# EAGLE design half-pint-turbidimeter_2.0.2 (EAGLE 7.3.0)
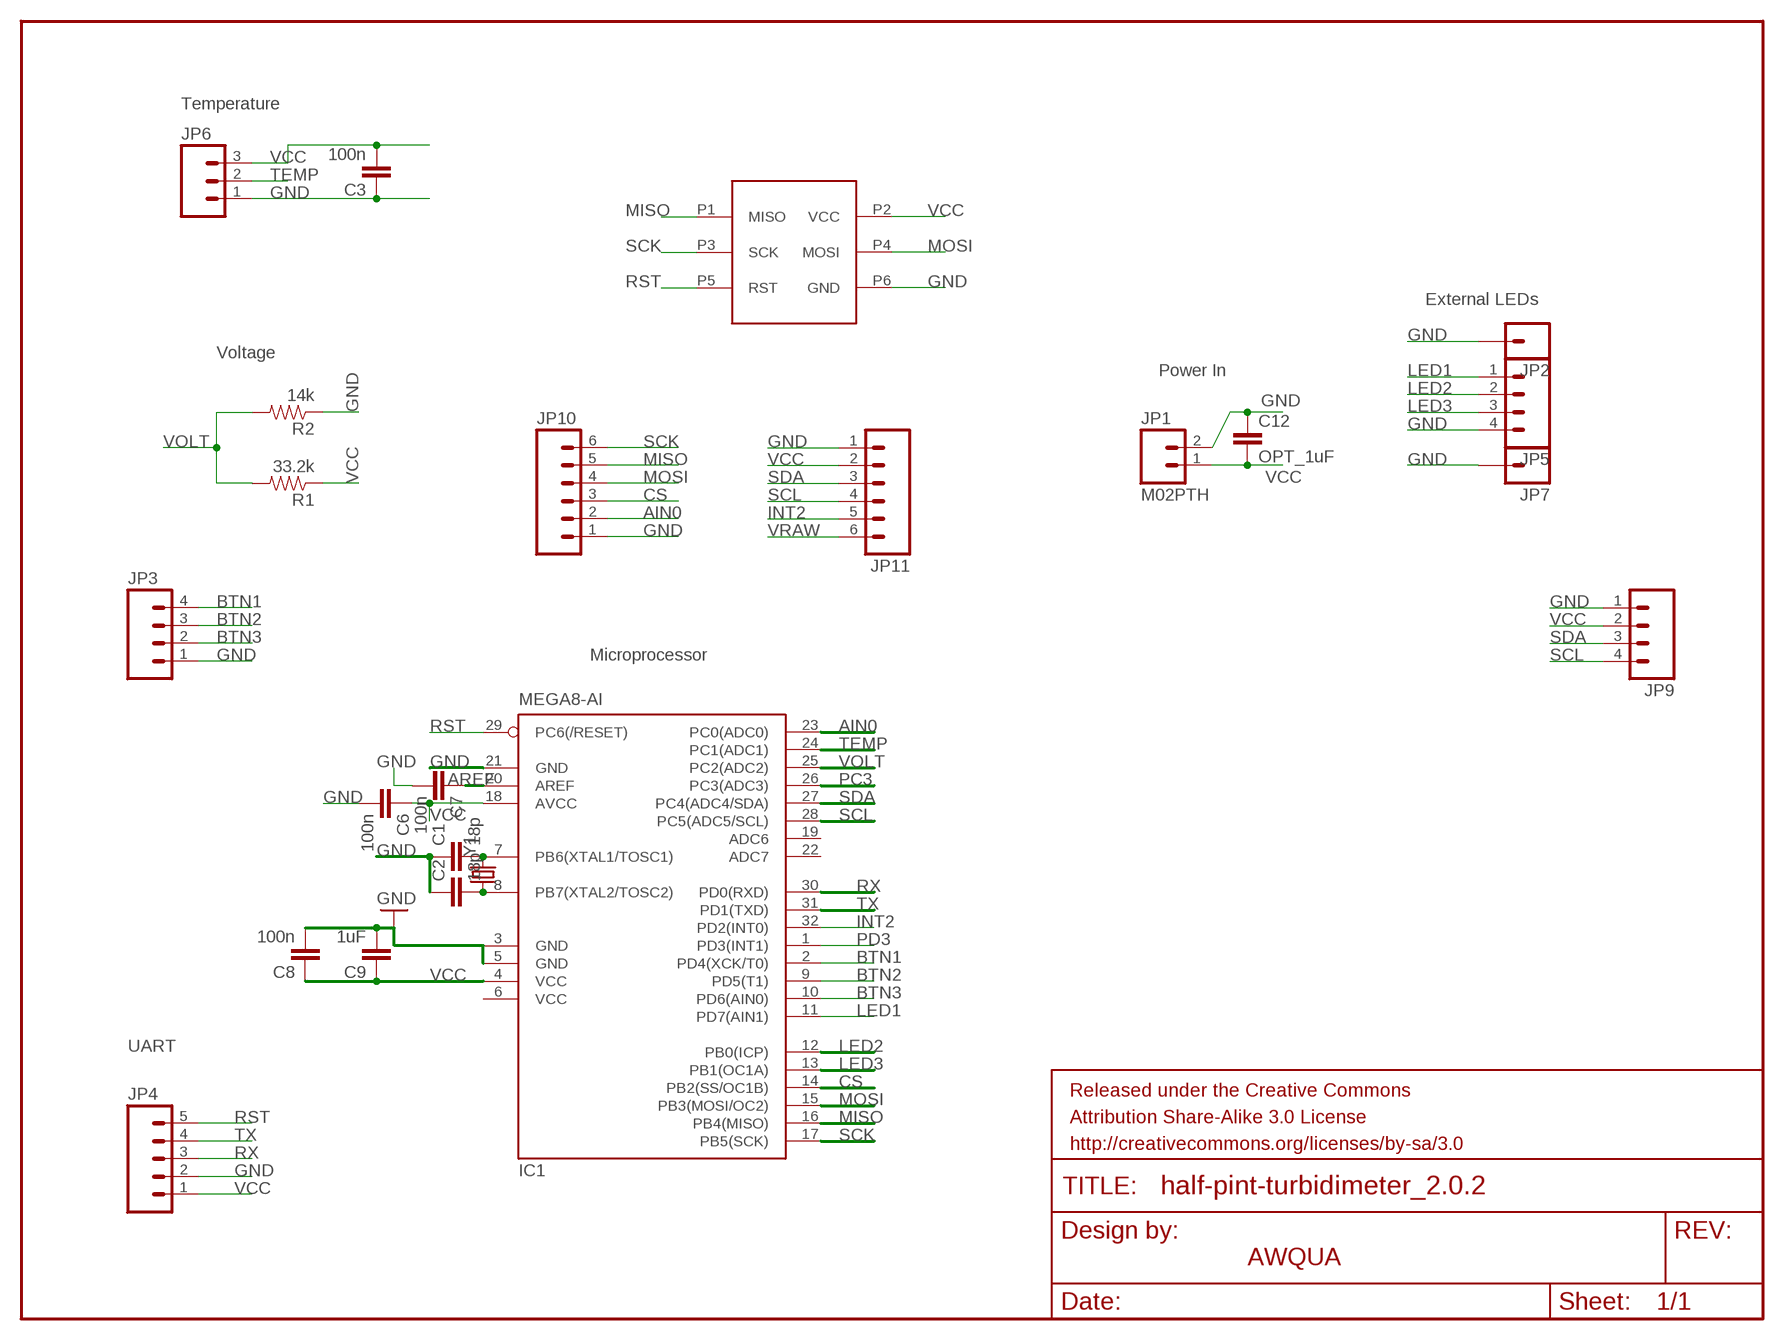
[diagram p0: schematic, sheet 1]

## Parts
C1  18p  CAP0603-CAP  [0603-CAP]
C2  18p  CAP0603-CAP  [0603-CAP]
C3  100n  CAP0603-CAP  [0603-CAP]
C6  100n  CAP0603-CAP  [0603-CAP]
C7  100n  CAP0603-CAP  [0603-CAP]
C8  100n  CAP0603-CAP  [0603-CAP]
C9  1uF  CAP0603-CAP  [0603-CAP]
C12  OPT_1uF  CAP0603-CAP  [0603-CAP]
FRAME1  FRAME-LETTER  [CREATIVE_COMMONS]
IC1  MEGA8-AI  [TQFP32-08]
JP1  M02PTH  [1X02]
JP2  M01PTH  [1X01]
JP3  M04PTH  [1X04]
JP4  M05PTH  [1X05]
JP5  M04PTH  [1X04]
JP6  M03PTH  [1X03]
JP7  M01PTH  [1X01]
JP9  M04PTH  [1X04]
JP10  M06SMD_MALE  [1X06_SMD_MALE]
JP11  M06SMD_MALE  [1X06_SMD_MALE]
R1  33.2k  RESISTOR0603  [0603-RES]
R2  14k  RESISTOR0603  [0603-RES]
U$1  ISP-SMD-6PIN  [ISP-SMD-6PIN]
Y1  CRYSTAL5X3  [CRYSTAL-SMD-5X3]

## Nets
AIN0: IC1.23(PC0(ADC0)) JP10.2
AREF: C7.1 IC1.20(AREF)
BTN1: IC1.2(PD4(XCK/T0)) JP3.4
BTN2: IC1.9(PD5(T1)) JP3.3
BTN3: IC1.10(PD6(AIN0)) JP3.2
CS: IC1.14(PB2(SS/OC1B)) JP10.3
GND: C1.1 C2.1 C3.1 C6.2 C7.2 C8.2 C9.2 C12.1 IC1.3(GND) IC1.5(GND) IC1.21(GND) JP1.2 JP2.1 JP3.1 JP4.2 JP5.4 JP6.1 JP7.1 JP9.1 JP10.1 JP11.1 R2.1 U$1.P6(GND)
INT2: IC1.32(PD2(INT0)) JP11.5
LED1: IC1.11(PD7(AIN1)) JP5.1
LED2: IC1.12(PB0(ICP)) JP5.2
LED3: IC1.13(PB1(OC1A)) JP5.3
MISO: IC1.16(PB4(MISO)) JP10.5 U$1.P1(MISO)
MOSI: IC1.15(PB3(MOSI/OC2)) JP10.4 U$1.P4(MOSI)
PC3: IC1.26(PC3(ADC3))
PD3: IC1.1(PD3(INT1))
Q1: C2.2 IC1.8(PB7(XTAL2/TOSC2)) Y1.1
Q2: C1.2 IC1.7(PB6(XTAL1/TOSC1)) Y1.3
RST: IC1.29(PC6(/RESET)) JP4.5 U$1.P5(RST)
RX: IC1.30(PD0(RXD)) JP4.3
SCK: IC1.17(PB5(SCK)) JP10.6 U$1.P3(SCK)
SCL: IC1.28(PC5(ADC5/SCL)) JP9.4 JP11.4
SDA: IC1.27(PC4(ADC4/SDA)) JP9.3 JP11.3
TEMP: IC1.24(PC1(ADC1)) JP6.2
TX: IC1.31(PD1(TXD)) JP4.4
VCC: C3.2 C6.1 C8.1 C9.1 C12.2 IC1.4(VCC) IC1.18(AVCC) JP1.1 JP4.1 JP6.3 JP9.2 JP11.2 R1.1 U$1.P2(VCC)
VOLT: IC1.25(PC2(ADC2)) R1.2 R2.2
VRAW: JP11.6
Unconnected: IC1.19(ADC6) IC1.22(ADC7)

## Notes on the sheet
- Temperature
- External LEDs
- Voltage
- Power In
- Microprocessor
- UART
- AWQUA

## Power pins joined to a net without a drawn wire
VCC: IC1.6(VCC)

## Library data of the parts
C1-C3 C6-C9 C12 = SparkFun:CAP: Capacitor Standard 0603 ceramic capacitor, and 0.1" leaded capacitor.
FRAME1 = SparkFun-Aesthetics:FRAME-LETTER: Schematic Frame Standard 8.5x11 US Letter frame
IC1 = atmel:MEGA8: MICROCONTROLLER 8 Kbytes FLASH, 1 kbytes SRAM, 512 bytes EEPROM, USART, 6-channel 10 bit ADC, 2-channel 8 bit ADC Pin compatible with Atmega48, ATMega88, ATMega168 Source: avr.lbr; MPN: ATMEGA8-16AU; OC_FARNELL: 9171371; OC_NEWARK: 73M8863
JP1 = SparkFun-Connectors:M02: Standard 2-pin 0.1" header. Use with - straight break away headers ( PRT-00116) - right angle break away headers (PRT-00553) - swiss pins (PRT-00743) - machine pins (PRT-00117) - female headers (PRT-00115) Molex polarized connector foot print use with: PRT-08233 with associated crimp pins and housings. 2.54_SCREWTERM for use with PRT-10571. 3.5mm Screw Terminal footprints for PRT-08084 5mm Screw Terminal footprints for use with PRT-08433
JP2 JP7 = SparkFun-Connectors:M01: Header 1 Standard 1-pin 0.1" header. Use with straight break away headers (SKU : PRT-00116), right angle break away headers (PRT-00553), swiss pins (PRT-00743), machine pins (PRT-00117), and female headers (PRT-00115).
JP3 JP5 JP9 = SparkFun-Connectors:M04: Header 4 Standard 4-pin 0.1" header. Use with straight break away headers (SKU : PRT-00116), right angle break away headers (PRT-00553), swiss pins (PRT-00743), machine pins (PRT-00117), and female headers (PRT-00115). Molex polarized connector foot print use with SKU : PRT-08231 with associated crimp pins and housings. 1MM SMD Version SKU: PRT-10208
JP4 = SparkFun-Connectors:M05: Header 5 Standard 5-pin 0.1" header. Use with straight break away headers (SKU : PRT-00116), right angle break away headers (PRT-00553), swiss pins (PRT-00743), machine pins (PRT-00117), and female headers (PRT-00115). Molex polarized connector foot print use with SKU : PRT-08230 with associated crimp pins and housings.
JP6 = SparkFun-Connectors:M03: Header 3 Standard 3-pin 0.1" header. Use with straight break away headers (SKU : PRT-00116), right angle break away headers (PRT-00553), swiss pins (PRT-00743), machine pins (PRT-00117), and female headers (PRT-00115). Molex polarized connector foot print use with SKU : PRT-08232 with associated crimp pins and housings.
JP10 JP11 = SparkFun-Connectors:M06: Header 6 Standard 6-pin 0.1" header. Use with straight break away headers (SKU : PRT-00116), right angle break away headers (PRT-00553), swiss pins (PRT-00743), machine pins (PRT-00117), and female headers (PRT-00115). Molex polarized connector foot print use with SKU : PRT-08094 with associated crimp pins and housings. NOTES ON THE VARIANTS LOCK and LOCK_LONGPADS... This footprint was designed to help hold the alignment of a through-hole component (i.e. 6-pin header) while soldering it into place. You may notice that each hole has been shifted either up or down by 0.005 of an inch from it's more standard position (which is a perfectly straight line). This slight alteration caused the pins (the squares in the middle) to touch the edges of the holes. Because they are alternating, it causes a "brace" to hold the component in place. 0.005 has proven to be the perfect amount of "off-center" position when using our standard breakaway headers. Although looks a little odd when you look at the bare footprint, once you have a header in there, the alteration is very hard to notice. Also,if you push a header all the way into place, it is covered up entirely on the bottom side. This idea of altering the position of holes to aid alignment will be further integrated into the Sparkfun Library for other footprints. It can help hold any component with 3 or more connection pins.; PROD_ID: CONN-11293
R1 R2 = SparkFun-Resistors:RESISTOR: Resistor Basic schematic elements and footprints for 0603, 1206, and PTH resistors.
U$1 = awqua_eagle_library:ISP-SMD-6PIN
Y1 = SparkFun:CRYSTAL: Crystals Various standard crystals. Proven footprints. Spark Fun Electronics SKU : COM-00534

## Board
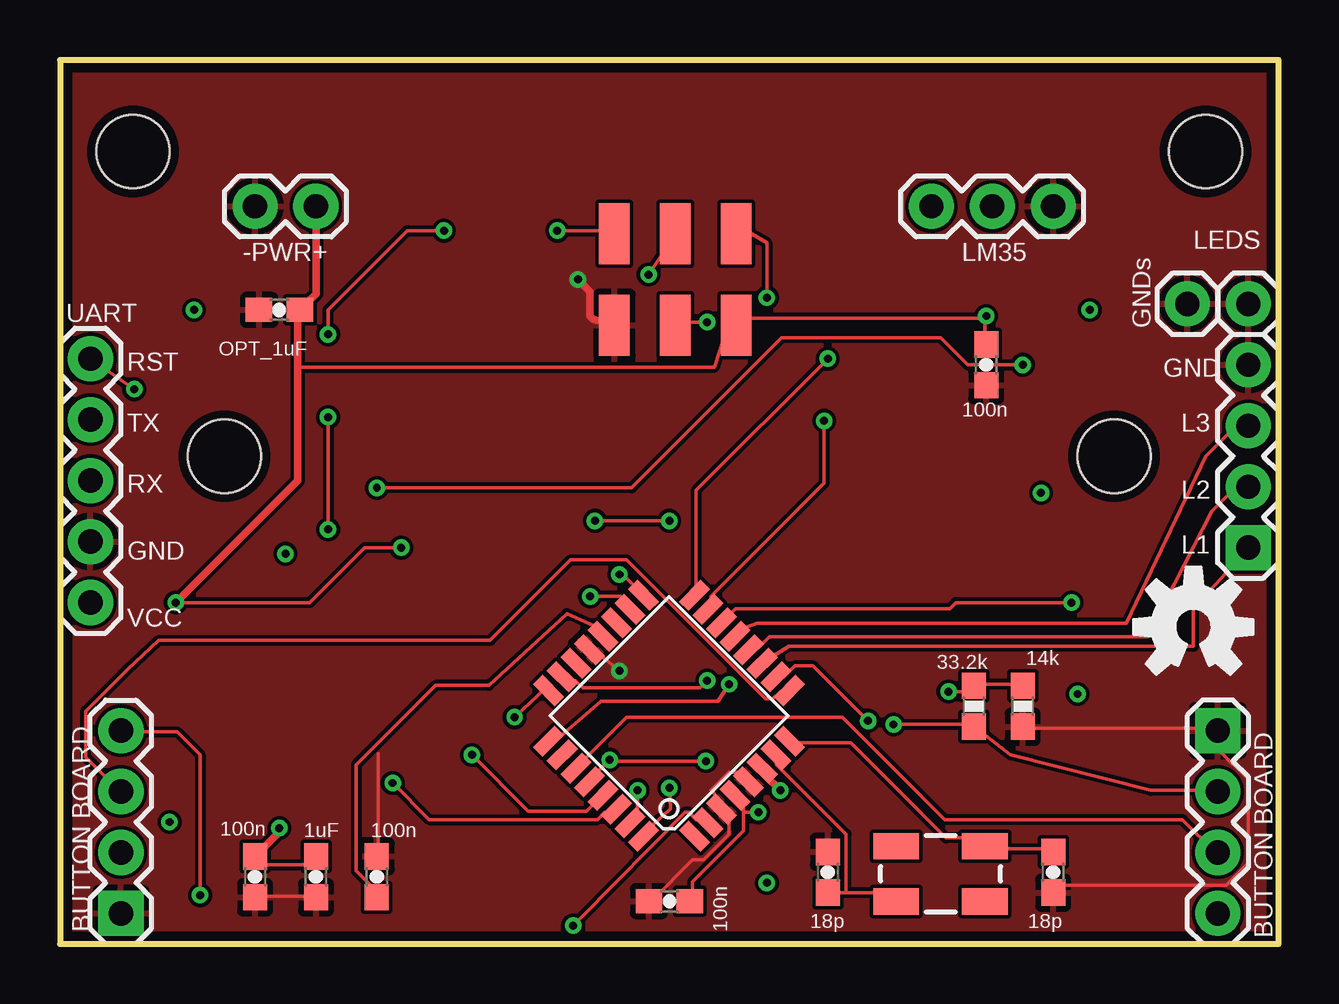
[diagram p1: board, top side]
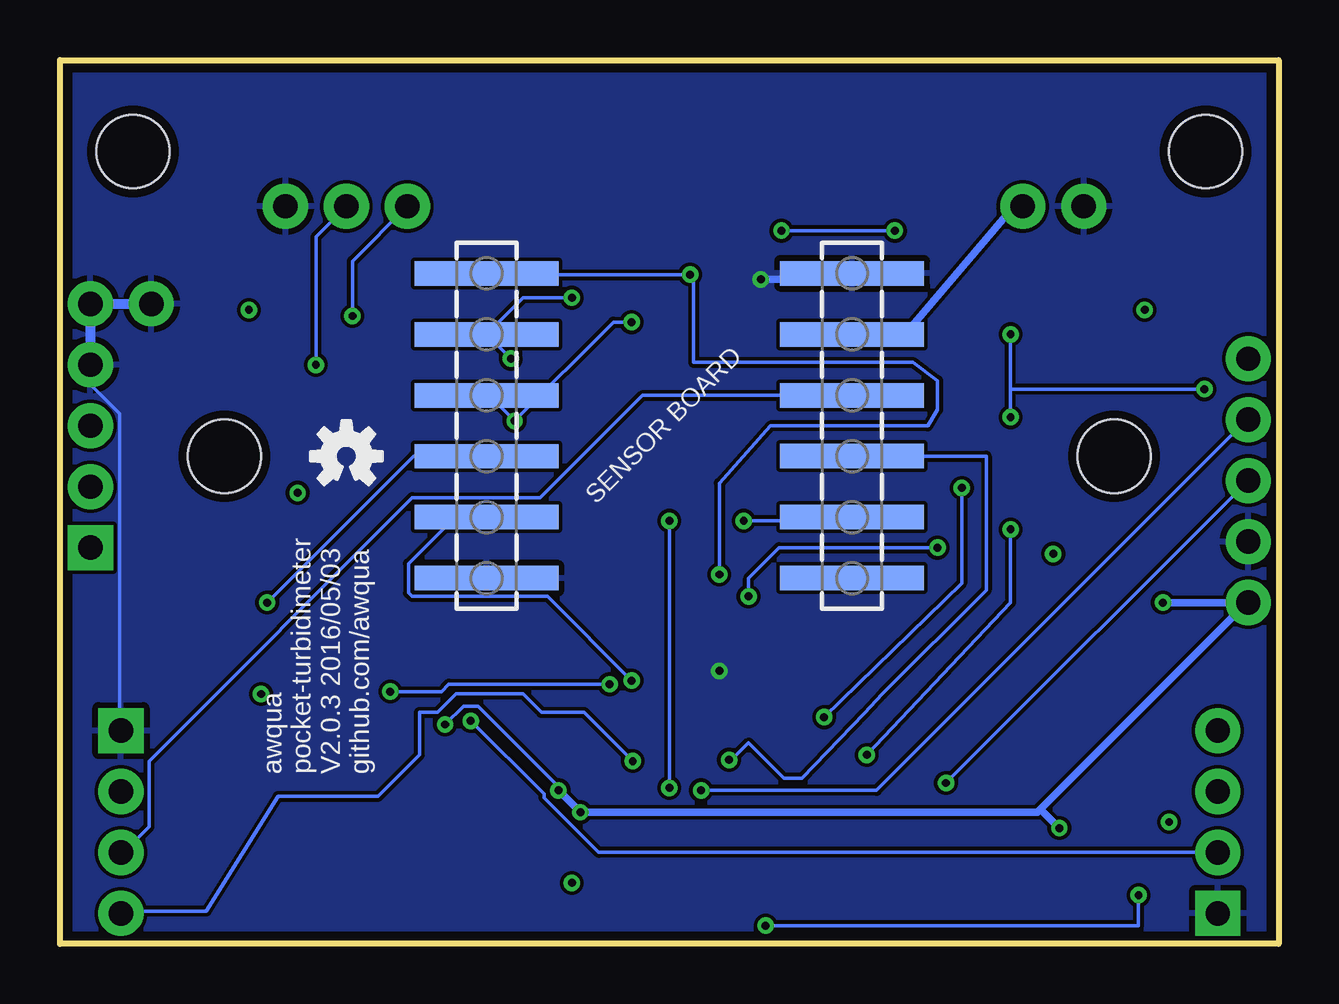
[diagram p2: board, bottom side, seen from below]

Size 50.8 x 36.83 mm. Coordinates in mm from the lower left corner, seen from the top.
Outline: 0,0 50.8,0 50.8,36.83 0,36.83 0,0
Copper layers (1*16): Top 0.0356mm / dielectric 1.5011mm / Bottom 0.0356mm
Design rules "default *": minimum track width 6mil, minimum drill 13mil, track to track 6mil, track to pad 6mil, pad to pad 6mil, via to via 6mil, smd to smd 6mil, copper to edge 15mil, drill to drill 6mil, minimum pad ring 7mil, minimum via ring 7mil, stop-mask expansion 4mil, vias tented up to drill 15mil, thermal gap 10mil
Holes 3.05 mm at 47.75,33.02 3.05,33.02 6.86,20.32 43.94,20.32

### Footprints (pad centres in the part's own frame; a part is rotated, then mirrored left to right if it is on the bottom)
0603-CAP = smd 1.1 x 1: 1 -0.85,0; 2 0.85,0
TQFP32-08 = smd 1.27 x 0.559: 1 -4.293,2.8; 2 -4.293,2; 3 -4.293,1.2; 4 -4.293,0.4; 5 -4.293,-0.4; 6 -4.293,-1.2; 7 -4.293,-2; 8 -4.293,-2.8; 17 4.293,-2.8; 18 4.293,-2; 19 4.293,-1.2; 20 4.293,-0.4; 21 4.293,0.4; 22 4.293,1.2; 23 4.293,2; 24 4.293,2.8 | smd 0.559 x 1.27: 9 -2.8,-4.293; 10 -2,-4.293; 11 -1.2,-4.293; 12 -0.4,-4.293; 13 0.4,-4.293; 14 1.2,-4.293; 15 2,-4.293; 16 2.8,-4.293; 25 2.8,4.293; 26 2,4.293; 27 1.2,4.293; 28 0.4,4.293; 29 -0.4,4.293; 30 -1.2,4.293; 31 -2,4.293; 32 -2.8,4.293
1X02 = drill 1.016 pad 1.88: 1 0,0; 2 2.54,0
1X01 = drill 1.016 pad 1.88: 1 0,0
1X04 = drill 1.016 pad 1.88 square: 1 0,0 | drill 1.016 pad 1.88: 2 2.54,0; 3 5.08,0; 4 7.62,0
1X05 = drill 1.016 pad 1.88: 1 0,0; 2 2.54,0; 3 5.08,0; 4 7.62,0; 5 10.16,0
1X03 = drill 1.016 pad 1.88: 1 0,0; 2 2.54,0; 3 5.08,0
1X06_SMD_MALE = smd 1.02 x 6: 1 0,0; 2 2.54,0; 3 5.08,0; 4 7.62,0; 5 10.16,0; 6 12.7,0
0603-RES = smd 1.1 x 1: 1 -0.85,0; 2 0.85,0
ISP-SMD-6PIN = smd 1.27 x 2.54: P1 2.54,1.905; P2 2.54,-1.905; P3 0,1.905; P4 0,-1.905; P5 -2.54,1.905; P6 -2.54,-1.905
CRYSTAL-SMD-5X3 = smd 1.9 x 1.1: 1 -1.85,-1.15; 2 1.85,-1.15; 3 1.85,1.15; 4 -1.85,1.15

### Placement (x,y rotation side)
C1  32,2.98 270 top
C2  41.4,2.98 90 top
C3  38.61,24.13 90 top
C6  25.4,1.78 180 top
C7  13.21,2.79 90 top
C8  8.13,2.79 270 top
C9  10.67,2.79 270 top
C12  9.14,26.42 0 top
FRAME1  20.95,-7.62 0 top  (outside the outline)
IC1  25.39,9.5 135 top
JP1  10.67,30.73 180 top
JP2  49.53,26.67 0 top
JP3  2.54,1.27 90 top
JP4  1.27,14.22 90 top
JP5  49.53,16.51 90 top
JP6  41.4,30.73 180 top
JP7  46.99,26.67 0 top
JP9  48.26,8.89 270 top
JP10  33.02,15.24 90 bottom
JP11  17.78,27.94 270 bottom
R1  38.1,9.91 90 top
R2  40.13,9.91 90 top
U$1  25.65,27.69 0 top
U$4  [OSHW-LOGO-M]  47.24,13.21 0 top
U$5  [OSHW-LOGO-S]  38.86,20.32 0 bottom
Y1  36.7,2.92 180 top

### Tracks (layer width: path | path; a pad name or v marks a point on that pad's centre or on a via)
AIN0  (via drill 0.33)
  Top 0.152: v26.98,10.97 26.67,10.67 21.79,10.67 21.49,10.97 21.03,10.97 IC1.23
  Bottom 0.152: v26.98,10.97 30.48,14.48 36.12,14.48 36.27,14.63 36.27,15.85 34.44,17.68 33.07,17.68 JP10.2
AREF
  Top 0.152: C7.1 13.11,1.98 13.11,2.29 12.34,3.05 12.34,7.47 15.65,10.77 17.88,10.77 21.13,13.77 22.25,13.26 22.55,12.95 IC1.20
BTN1  (via drill 0.33)
  Top 0.152: IC1.2 26.98,5.18 26.52,5.18 26.21,5.49 26.06,5.49 21.69,1.07 v21.39,0.76 | JP3.4 2.59,8.84 4.88,8.84 5.84,7.87 v5.84,2.03
  Bottom 0.152: v5.84,2.03 5.84,0.76 v21.39,0.76
BTN2
  Top 0.152: IC1.9 30.33,10.52 30.02,10.52 29.72,10.21 29.41,10.21 23.62,16 21.29,16 17.93,12.65 4.12,12.65 2.79,11.43 1.07,9.7 1.07,7.77 2.44,6.4 JP3.3
BTN3  (via drill 0.33)
  Top 0.152: v33.68,9.3 31.39,11.58 30.63,11.58 30.18,11.12 29.87,11.12 IC1.10
  Bottom 0.152: v33.68,9.3 30.63,6.25 30.63,6.1 28.35,3.81 JP3.2
CS  (via drill 0.33)
  Top 0.152: v42.16,14.22 37.34,14.22 37.08,13.97 28.16,13.97 IC1.14
  Bottom 0.152: JP10.3 36.07,20.32 v42.16,14.22
GND  (via drill 0.33)
  Top 0.152: 13.26,7.92 13.26,3.66 C7.2 13.21,3.56 | 21.64,12.65 21.95,12.34 IC1.21 22.1,12.19 22.4,12.19 22.71,11.89 v23.32,11.38 | R2.1 40.23,8.99 48.16,8.99 JP9.1 48.31,8.84 48.31,8.08 49.53,6.86 49.53,3.35 48.62,2.44 41.6,2.44 41.45,2.29 C2.1 | C8.2 8.23,1.98 10.67,1.98 C9.2 | C6.2 24.69,1.83 26.36,3.5 26.82,3.5 27.89,4.57 27.89,5.18 27.58,5.49 IC1.3 27.43,5.64 27.43,6.1 27.13,6.4 27.89,7.16 28.35,7.16 28.65,6.86 IC1.5
  Top 0.305: U$1.P6 22.23,26.04 22.1,26.16 22.1,27.18 v21.59,27.69
  Bottom 0.152: JP5.4 49.53,23.32 48.31,22.1 48.31,8.99 JP9.1
  Bottom 0.305: v21.59,27.69 18.03,27.69 JP11.1
  Bottom 0.406: JP5.4 JP2.1 JP7.1
  pour Top: -7.62,-7.11 58.17,-2.79 57.4,40.64 -7.62,38.35
  pour Bottom: -5.08,39.12 53.85,39.62 52.58,-7.62 -6.1,-6.86
INT2  (via drill 0.33)
  Top 0.152: v25.4,6.5 25.45,5.64 25.4,5.59 24.94,5.18 24.64,4.88 24.38,4.57 IC1.32 | v22.3,17.63 v25.4,17.63
  Bottom 0.152: v25.4,17.63 v25.4,6.5 | v22.3,17.63 20.47,17.63 19.3,17.53 19.2,17.68 17.83,17.68 JP11.5
LED1
  Top 0.152: IC1.11 29.41,11.73 29.72,11.99 30.38,12.39 47.24,12.39 47.24,13.97 49.53,16.46 JP5.1
LED2
  Top 0.152: JP5.2 49.02,19.05 48.01,18.03 45.31,12.8 29.57,12.8 29.11,12.34 28.8,12.34 IC1.12
LED3
  Top 0.152: IC1.13 28.19,12.95 28.65,13.21 29.06,13.36 44.45,13.36 47.75,20.32 48.92,21.49 49.53,21.49 JP5.3
MISO  (via drill 0.33)
  Top 0.152: v32,24.38 26.52,18.9 26.52,14.63 IC1.16 | 28.19,29.72 U$1.P1 28.83,29.59 29.46,29.21 v29.46,26.92
  Bottom 0.152: JP10.5 v32,24.38 | 32.92,25.3 JP10.5 | v29.46,26.92 31.5,26.92 JP10.5
MOSI  (via drill 0.33)
  Top 0.152: v31.85,21.79 31.85,19.2 27.13,14.48 27.13,14.02 IC1.15 | v26.98,25.91 25.76,25.91 U$1.P4
  Bottom 0.152: JP10.4 32.92,22.86 v31.85,21.79 27.74,25.91 v26.98,25.91
N$1  (via drill 0.33)
  other vias: 42.93,26.42
N$2  (via drill 0.33)
  other vias: 40.89,18.8
N$3  (via drill 0.33)
  other vias: 29.46,2.54
N$4  (via drill 0.33)
  other vias: 4.57,5.08
N$7  (via drill 0.33)
  other vias: 5.59,26.42
N$8  (via drill 0.33)
  other vias: 42.42,10.41
N$9  (via drill 0.33)
  other vias: 9.4,16.26
Q1
  Top 0.152: C2.2 41.3,3.96 38.86,3.96 38.56,4.27 Y1.1 38.41,4.42 36.93,4.42 32.97,8.38 30.48,8.38 IC1.8
Q2
  Top 0.152: 32.77,2.13 34.75,2.13 Y1.3 | 32.77,2.13 C1.2 | 32.77,2.13 32.77,4.57 29.87,7.47 29.87,7.77 IC1.7
RST  (via drill 0.33)
  Top 0.152: v17.17,7.87 19.51,5.54 21.95,5.54 22.5,6.1 22.55,6.1 IC1.29 | v11.18,21.95 v11.18,17.27 | JP4.5 v3.1,23.11 | v20.73,29.72 23.01,29.72 U$1.P5 | v11.18,25.4 11.18,26.42 14.48,29.72 v16,29.72
  Bottom 0.152: v17.17,7.87 11.18,14.22 v11.18,17.27 | v3.1,23.11 11.18,23.11 | v16,29.72 v20.73,29.72 | v11.18,21.95 11.18,23.11 | 11.18,23.11 v11.18,25.4
RX  (via drill 0.33)
  Top 0.152: v13.87,6.71 15.39,5.18 22.4,5.18 22.71,5.49 23.16,5.49 IC1.30
  Bottom 0.152: JP4.3 v13.87,6.71
SCK  (via drill 0.33)
  Top 0.152: v23.32,15.39 23.47,15.39 24.23,14.63 IC1.17 | v24.54,27.89 25.76,29.72 U$1.P3
  Bottom 0.152: v23.32,15.39 23.32,19.2 21.18,21.59 14.63,21.59 14.22,22.25 14.22,23.47 15.24,24.23 24.38,24.23 24.38,27.89 v24.54,27.89 32.92,27.89 JP10.6
SCL  (via drill 0.33)
  Top 0.152: IC1.28 22.1,6.86 v22.91,7.67 22.96,7.62 v26.92,7.62
  Bottom 0.152: v22.91,7.67 22.81,7.67 22.1,8.38 20.62,6.91 19.86,6.91 17.27,9.6 16.51,10.41 12.19,14.73 12.19,20.32 19.2,20.32 17.83,20.27 JP11.4 | JP9.4 48.16,1.37 44.7,1.37 41.71,6.15 37.54,6.15 35.81,7.87 35.81,9.65 35.05,9.65 34.29,10.41 31.5,10.41 30.73,9.65 28.96,9.65 v26.92,7.62
SDA
  Top 0.152: IC1.27 21.64,7.47 23.62,9.45 32.61,9.45 36.88,5.18 46.79,5.18 48.16,3.81 JP9.3
  Bottom 0.152: JP11.3 26.52,22.86 30.79,18.59 36.12,18.59 47.09,7.62 47.09,4.88 48.16,3.81 JP9.3
TEMP  (via drill 0.33)
  Top 0.152: v18.95,9.45 20.27,10.67 IC1.24 | v13.21,19 23.82,19 30.07,25.25 36.73,25.25 37.85,24.13 v40.13,24.13
  Bottom 0.152: v18.95,9.45 13.21,15.04 v13.21,19 | v40.13,24.13 40.13,29.46 JP6.2
TX  (via drill 0.33)
  Top 0.152: v24.08,6.4 24.08,5.49 23.77,5.18 IC1.31
  Bottom 0.152: v24.08,6.4 16.76,6.4 1.37,21.79 JP4.4
VCC  (via drill 0.33)
  Top 0.152: 38.56,26.06 38.56,24.99 C3.2 | 38.56,26.06 28.19,26.06 U$1.P2 28.19,25.91 27.89,25.91 27.28,24.03 9.91,24.03 | JP9.2 48.16,6.4 45.47,6.4 39.62,7.87 38.2,8.99 38.1,8.99 R1.1 38.1,9.14 v34.75,9.14 | 28.5,5.49 28.5,5.79 28.19,6.1 IC1.4 | 28.5,5.49 28.5,4.72 26.36,2.59 26.36,1.83 C6.1 | 29.41,7.01 29.41,7.32 IC1.6 | 28.5,5.49 v29.11,5.49 | 8.08,3.66 C8.1 8.13,3.3 10.67,3.3 C9.1 | 9.91,26.36 C12.2 | 1.37,14.33 JP4.1 | 10.67,30.63 JP1.1 | IC1.18 23.77,14.08 23.37,14.48 v22.1,14.48 | v14.22,16.51 12.7,16.51 10.41,14.22 v4.83,14.22 | 38.56,26.06 38.56,26.11 v38.61,26.16
  Top 0.305: v30.02,6.4 29.41,7.01 | 10.67,30.63 10.67,27.09 C12.2 | 9.91,26.36 9.91,24.03 9.91,19.3 v4.83,14.22 | v9.14,4.83 9.14,4.66 C8.1
  Bottom 0.152: 10.67,30.63 JP1.1 | 17.68,25.45 JP11.2 | 1.37,14.17 JP4.1 | v34.75,9.14 33.98,9.91 33.38,9.91 30.02,6.55 v30.02,6.4 | 10.06,5.49 9.8,5.49 | v22.1,14.48 22.1,15.24 20.83,16.51 v14.22,16.51 | v38.61,26.16 38.61,28.45 JP6.3
  Bottom 0.305: 10.67,30.63 11.12,30.63 15.54,25.45 17.68,25.45 | v30.02,6.4 v29.11,5.49 10.06,5.49 1.37,14.17 | v4.83,14.22 JP4.1 | 9.8,5.49 v9.14,4.83
VOLT  (via drill 0.33)
  Top 0.152: R2.2 40.08,10.82 38.1,10.82 R1.2 38.1,10.67 37.95,10.52 v37.03,10.52 | v27.89,10.82 27.43,10.11 22.55,10.11 20.73,8.53 20.42,8.53 IC1.25
  Bottom 0.152: v27.89,10.82 34.59,10.82 34.9,10.52 v37.03,10.52

### Text on the board
bPlace: awqua / pocket-turbidimeter / V2.0.3 2016/05/03 / github.com/awqua
tNames: LEDS | -PWR+ | LM35 | UART | GNDs | RST | GND | TX | L3 | RX | L2 | GND | L1 | VCC | BUTTON BOARD | BUTTON BOARD
bNames: SENSOR BOARD